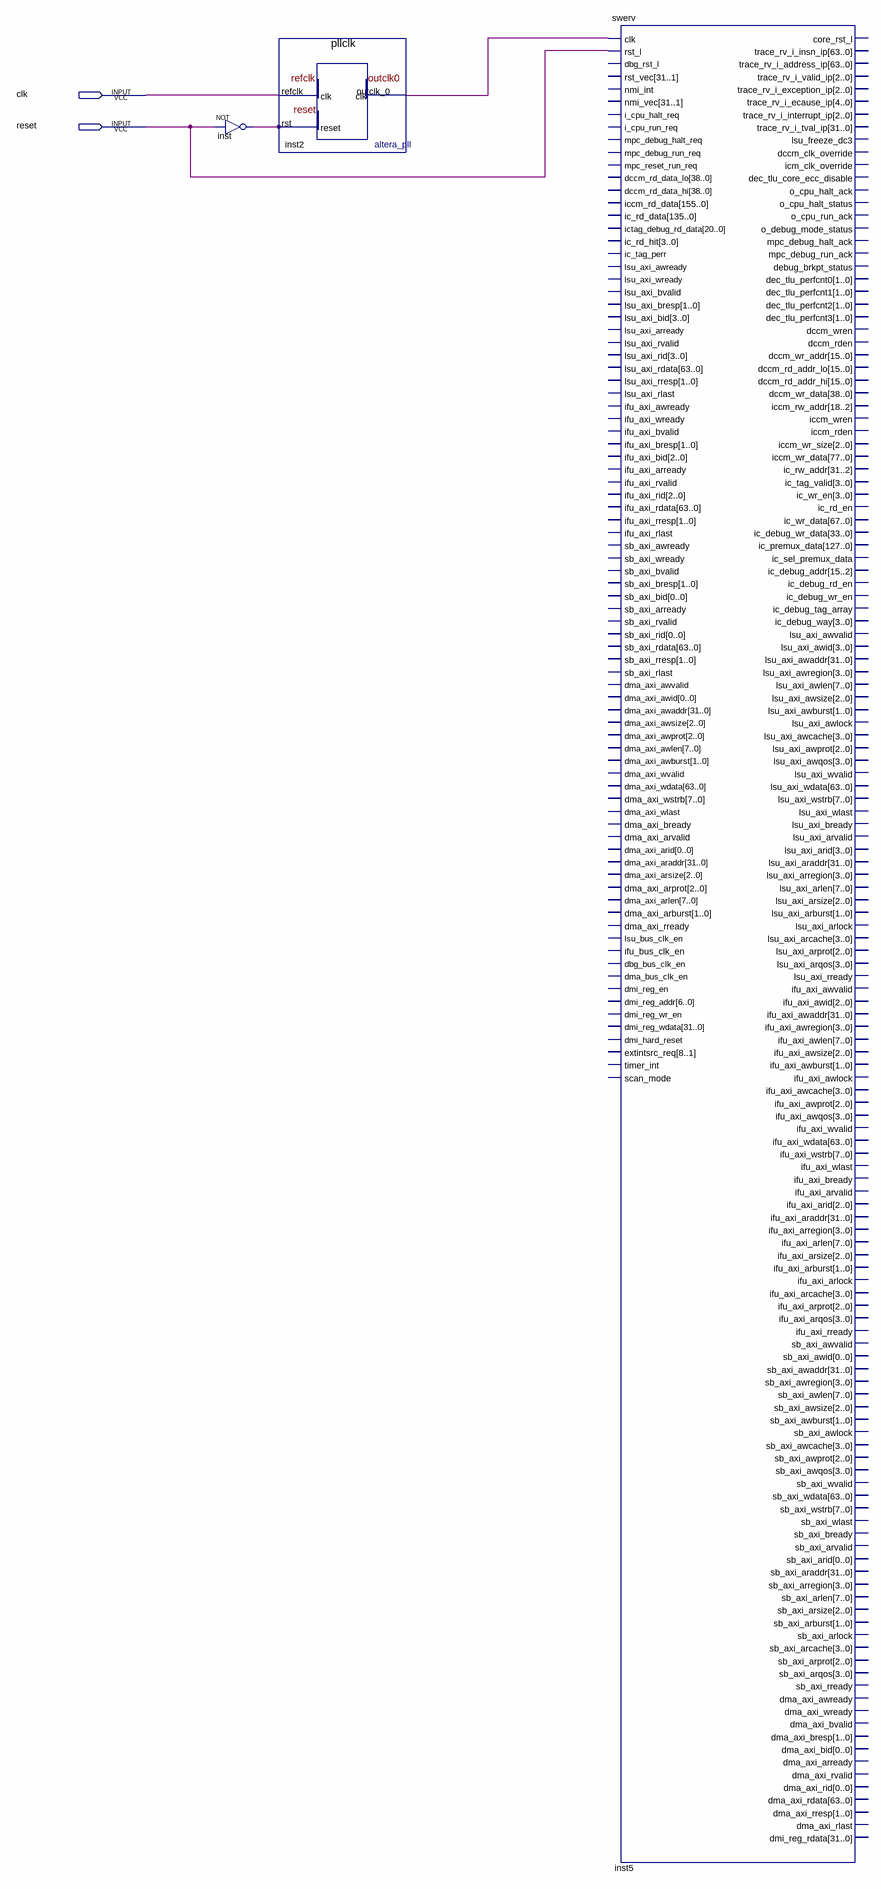
[diagram p0: schematic sheet]
// Quartus schematic block.bdf as structural Verilog: 3 symbols, 2 pins
module block (
  input  clk,
  input  reset
);

  wire inst2_outclk_0, inst_out;

  not inst (inst_out, reset);
  pllclk inst2 (.refclk(clk), .rst(inst_out), .outclk_0(inst2_outclk_0));
  swerv inst5 (
    .clk(inst2_outclk_0), .rst_l(reset));  // open: dbg_rst_l, rst_vec, nmi_int, nmi_vec, i_cpu_halt_req, i_cpu_run_req, mpc_debug_halt_req, mpc_debug_run_req, mpc_reset_run_req, dccm_rd_data_lo, dccm_rd_data_hi, iccm_rd_data, ic_rd_data, ictag_debug_rd_data, ic_rd_hit, ic_tag_perr, lsu_axi_awready, lsu_axi_wready, lsu_axi_bvalid, lsu_axi_bresp, lsu_axi_bid, lsu_axi_arready, lsu_axi_rvalid, lsu_axi_rid, lsu_axi_rdata, lsu_axi_rresp, lsu_axi_rlast, ifu_axi_awready, ifu_axi_wready, ifu_axi_bvalid, ifu_axi_bresp, ifu_axi_bid, ifu_axi_arready, ifu_axi_rvalid, ifu_axi_rid, ifu_axi_rdata, ifu_axi_rresp, ifu_axi_rlast, sb_axi_awready, sb_axi_wready, sb_axi_bvalid, sb_axi_bresp, sb_axi_bid, sb_axi_arready, sb_axi_rvalid, sb_axi_rid, sb_axi_rdata, sb_axi_rresp, sb_axi_rlast, dma_axi_awvalid, dma_axi_awid, dma_axi_awaddr, dma_axi_awsize, dma_axi_awprot, dma_axi_awlen, dma_axi_awburst, dma_axi_wvalid, dma_axi_wdata, dma_axi_wstrb, dma_axi_wlast, dma_axi_bready, dma_axi_arvalid, dma_axi_arid, dma_axi_araddr, dma_axi_arsize, dma_axi_arprot, dma_axi_arlen, dma_axi_arburst, dma_axi_rready, lsu_bus_clk_en, ifu_bus_clk_en, dbg_bus_clk_en, dma_bus_clk_en, dmi_reg_en, dmi_reg_addr, dmi_reg_wr_en, dmi_reg_wdata, dmi_hard_reset, extintsrc_req, timer_int, scan_mode, core_rst_l, trace_rv_i_insn_ip, trace_rv_i_address_ip, trace_rv_i_valid_ip, trace_rv_i_exception_ip, trace_rv_i_ecause_ip, trace_rv_i_interrupt_ip, trace_rv_i_tval_ip, lsu_freeze_dc3, dccm_clk_override, icm_clk_override, dec_tlu_core_ecc_disable, o_cpu_halt_ack, o_cpu_halt_status, o_cpu_run_ack, o_debug_mode_status, mpc_debug_halt_ack, mpc_debug_run_ack, debug_brkpt_status, dec_tlu_perfcnt0, dec_tlu_perfcnt1, dec_tlu_perfcnt2, dec_tlu_perfcnt3, dccm_wren, dccm_rden, dccm_wr_addr, dccm_rd_addr_lo, dccm_rd_addr_hi, dccm_wr_data, iccm_rw_addr, iccm_wren, iccm_rden, iccm_wr_size, iccm_wr_data, ic_rw_addr, ic_tag_valid, ic_wr_en, ic_rd_en, ic_wr_data, ic_debug_wr_data, ic_premux_data, ic_sel_premux_data, ic_debug_addr, ic_debug_rd_en, ic_debug_wr_en, ic_debug_tag_array, ic_debug_way, lsu_axi_awvalid, lsu_axi_awid, lsu_axi_awaddr, lsu_axi_awregion, lsu_axi_awlen, lsu_axi_awsize, lsu_axi_awburst, lsu_axi_awlock, lsu_axi_awcache, lsu_axi_awprot, lsu_axi_awqos, lsu_axi_wvalid, lsu_axi_wdata, lsu_axi_wstrb, lsu_axi_wlast, lsu_axi_bready, lsu_axi_arvalid, lsu_axi_arid, lsu_axi_araddr, lsu_axi_arregion, lsu_axi_arlen, lsu_axi_arsize, lsu_axi_arburst, lsu_axi_arlock, lsu_axi_arcache, lsu_axi_arprot, lsu_axi_arqos, lsu_axi_rready, ifu_axi_awvalid, ifu_axi_awid, ifu_axi_awaddr, ifu_axi_awregion, ifu_axi_awlen, ifu_axi_awsize, ifu_axi_awburst, ifu_axi_awlock, ifu_axi_awcache, ifu_axi_awprot, ifu_axi_awqos, ifu_axi_wvalid, ifu_axi_wdata, ifu_axi_wstrb, ifu_axi_wlast, ifu_axi_bready, ifu_axi_arvalid, ifu_axi_arid, ifu_axi_araddr, ifu_axi_arregion, ifu_axi_arlen, ifu_axi_arsize, ifu_axi_arburst, ifu_axi_arlock, ifu_axi_arcache, ifu_axi_arprot, ifu_axi_arqos, ifu_axi_rready, sb_axi_awvalid, sb_axi_awid, sb_axi_awaddr, sb_axi_awregion, sb_axi_awlen, sb_axi_awsize, sb_axi_awburst, sb_axi_awlock, sb_axi_awcache, sb_axi_awprot, sb_axi_awqos, sb_axi_wvalid, sb_axi_wdata, sb_axi_wstrb, sb_axi_wlast, sb_axi_bready, sb_axi_arvalid, sb_axi_arid, sb_axi_araddr, sb_axi_arregion, sb_axi_arlen, sb_axi_arsize, sb_axi_arburst, sb_axi_arlock, sb_axi_arcache, sb_axi_arprot, sb_axi_arqos, sb_axi_rready, dma_axi_awready, dma_axi_wready, dma_axi_bvalid, dma_axi_bresp, dma_axi_bid, dma_axi_arready, dma_axi_rvalid, dma_axi_rid, dma_axi_rdata, dma_axi_rresp, dma_axi_rlast, dmi_reg_rdata
endmodule
